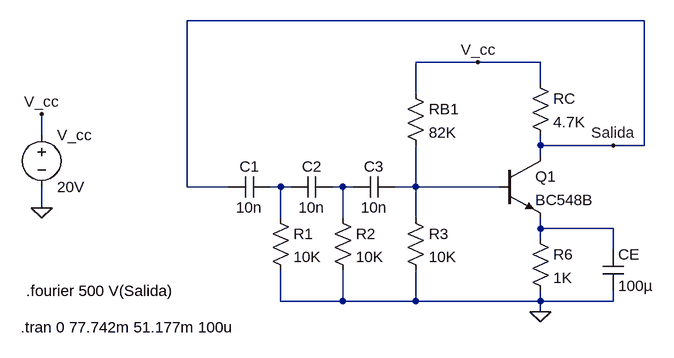
[diagram p0: schematic oscilador.asc]
oscilador.asc, the LTspice schematic file:
Version 4
SHEET 1 880 680
WIRE 704 -112 0 -112
WIRE 448 -48 352 -48
WIRE 544 -48 448 -48
WIRE 544 -16 544 -48
WIRE 352 0 352 -48
WIRE -224 64 -224 32
WIRE 544 80 544 64
WIRE 656 80 544 80
WIRE 704 80 704 -112
WIRE 704 80 656 80
WIRE 544 96 544 80
WIRE 0 144 0 -112
WIRE 64 144 0 144
WIRE 144 144 128 144
WIRE 160 144 144 144
WIRE 240 144 224 144
WIRE 256 144 240 144
WIRE 352 144 352 80
WIRE 352 144 320 144
WIRE 480 144 352 144
WIRE -224 176 -224 144
WIRE 144 192 144 144
WIRE 240 192 240 144
WIRE 352 192 352 144
WIRE 544 208 544 192
WIRE 656 208 544 208
WIRE 544 224 544 208
WIRE 656 240 656 208
WIRE 144 320 144 272
WIRE 240 320 240 272
WIRE 240 320 144 320
WIRE 352 320 352 272
WIRE 352 320 240 320
WIRE 544 320 544 304
WIRE 544 320 352 320
WIRE 656 320 656 304
WIRE 656 320 544 320
WIRE 544 336 544 320
FLAG 544 336 0
FLAG 448 -48 V_cc
FLAG -224 32 V_cc
FLAG -224 176 0
FLAG 656 80 Salida
SYMBOL cap 128 128 R90
WINDOW 0 0 32 VBottom 2
WINDOW 3 32 32 VTop 2
SYMATTR InstName C1
SYMATTR Value 10n
SYMBOL cap 224 128 R90
WINDOW 0 0 32 VBottom 2
WINDOW 3 32 32 VTop 2
SYMATTR InstName C2
SYMATTR Value 10n
SYMBOL cap 320 128 R90
WINDOW 0 0 32 VBottom 2
WINDOW 3 32 32 VTop 2
SYMATTR InstName C3
SYMATTR Value 10n
SYMBOL res 128 176 R0
SYMATTR InstName R1
SYMATTR Value 10K
SYMBOL res 224 176 R0
SYMATTR InstName R2
SYMATTR Value 10K
SYMBOL res 336 176 R0
SYMATTR InstName R3
SYMATTR Value 10K
SYMBOL res 336 -16 R0
SYMATTR InstName RB1
SYMATTR Value 82K
SYMBOL res 528 -32 R0
SYMATTR InstName RC
SYMATTR Value 4.7K
SYMBOL res 528 208 R0
SYMATTR InstName R6
SYMATTR Value 1K
SYMBOL cap 640 240 R0
SYMATTR InstName CE
SYMATTR Value 100µ
SYMBOL npn 480 96 R0
SYMATTR InstName Q1
SYMATTR Value BC548B
SYMBOL voltage -224 48 R0
WINDOW 123 0 0 Left 0
WINDOW 39 0 0 Left 0
SYMATTR InstName V_cc
SYMATTR Value 20V
TEXT -256 360 Left 2 !.tran 0 77.742m 51.177m 100u
TEXT -248 304 Left 2 !.fourier 500 V(Salida)

The netlist it stands for:
* oscilador.asc
C1 N001 Salida 10n
C2 N002 N001 10n
C3 N003 N002 10n
R1 N001 0 10K
R2 N002 0 10K
R3 N003 0 10K
RB1 V_cc N003 82K
RC V_cc Salida 4.7K
R6 N004 0 1K
CE N004 0 100µ
Q1 Salida N003 N004 0 BC548B
V_cc V_cc 0 20V
.model NPN NPN
.model PNP PNP
.lib standard.bjt
.tran 0 77.742m 51.177m 100u
.fourier 500 V(Salida)
.backanno
.end